# EAGLE design watch_v1_flex_parts_test-rotated (EAGLE 9.6.2)
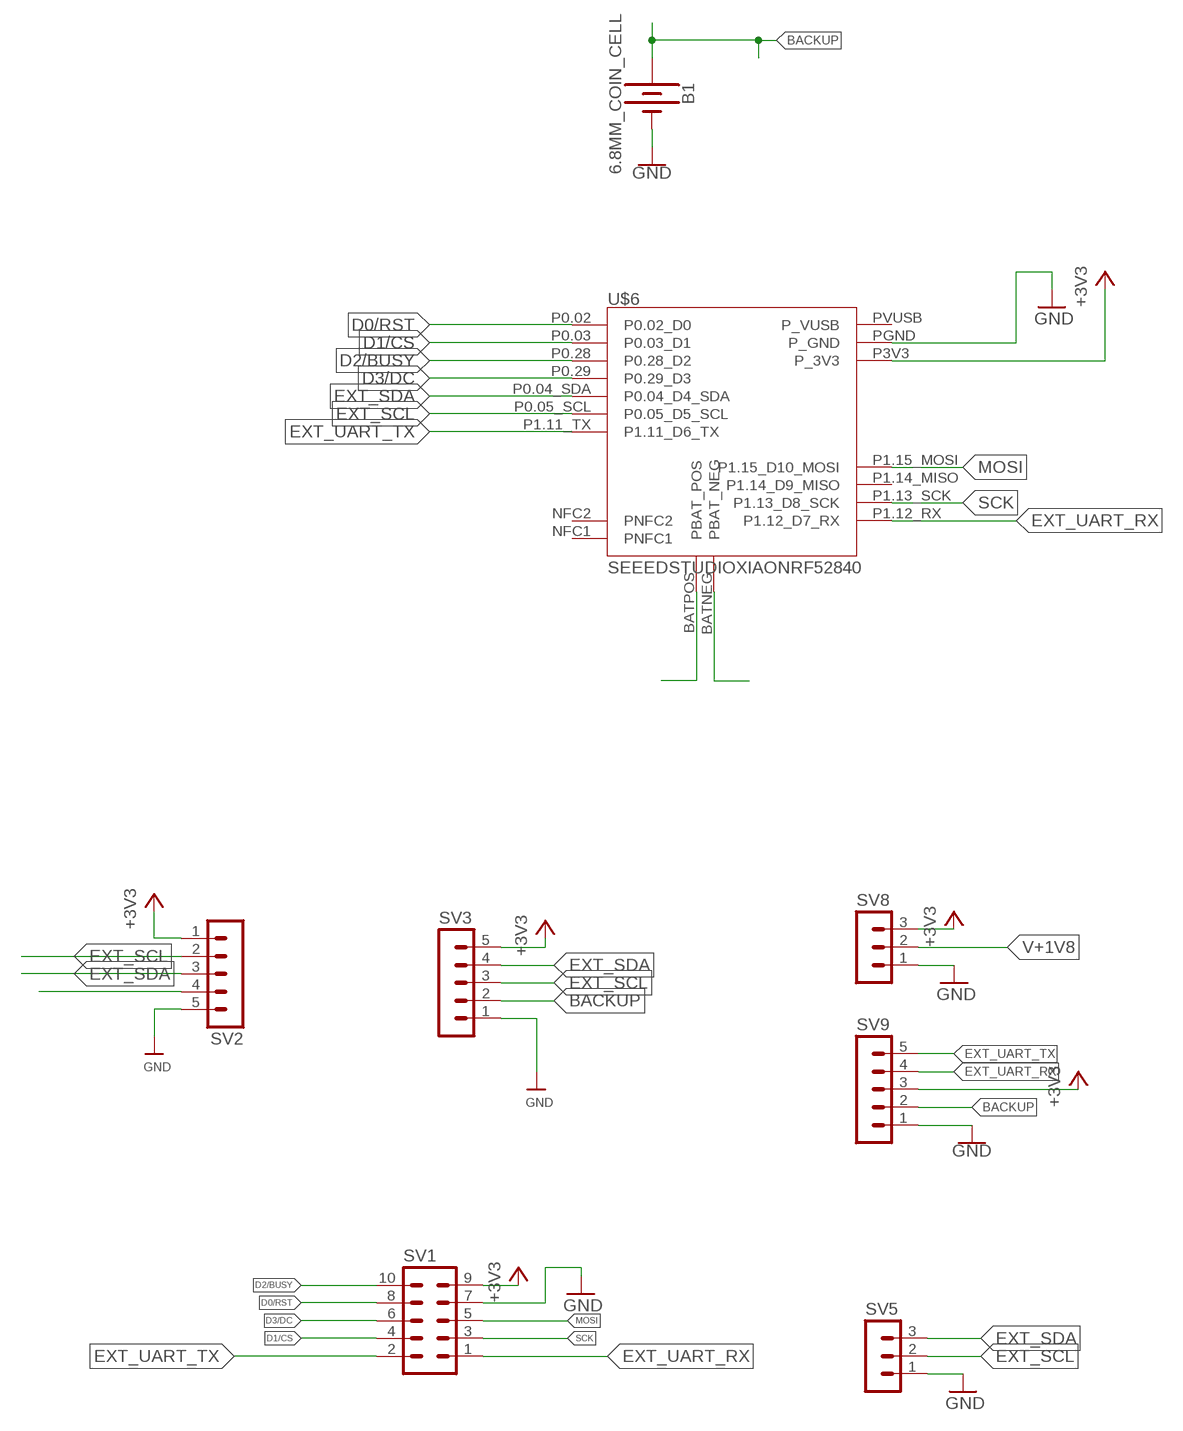
[diagram p0: schematic, sheet 1]

## Parts
B1  6.8MM_COIN_CELL  ML414H_IV01E_BATTERY  [ML414H_IV01E]
SV1  MA05-2  [MA05-2]
SV2  MA05-1  [MA05-1]
SV3  MA05-1  [MA05-1]
SV5  MA03-1  [MA03-1]
SV8  MA03-1  [MA03-1]
SV9  MA05-1  [MA05-1]
U$6  SEEEDSTUDIOXIAONRF52840  [SEEEDSTUDIOXIAONRF52840]

## Nets
+3V3: SV1.9 SV2.1 SV3.5 SV8.3 SV9.3 U$6.P3V3(P_3V3)
BACKUP: B1.+ SV3.2 SV9.2
D0/RST: SV1.8 U$6.P0.02(P0.02_D0)
D1/CS: SV1.4 U$6.P0.03(P0.03_D1)
D2/BUSY: SV1.10 U$6.P0.28(P0.28_D2)
D3/DC: SV1.6 U$6.P0.29(P0.29_D3)
EXT_SCL: SV2.2 SV3.3 SV5.2 U$6.P0.05_SCL(P0.05_D5_SCL)
EXT_SDA: SV2.3 SV3.4 SV5.3 U$6.P0.04_SDA(P0.04_D4_SDA)
EXT_UART_RX: SV1.1 SV9.4 U$6.P1.12_RX(P1.12_D7_RX)
EXT_UART_TX: SV1.2 SV9.5 U$6.P1.11_TX(P1.11_D6_TX)
GND: B1.- SV1.7 SV2.5 SV3.1 SV5.1 SV8.1 SV9.1 U$6.PGND(P_GND)
MOSI: SV1.5 U$6.P1.15_MOSI(P1.15_D10_MOSI)
N$1: SV2.4
N$18: U$6.BATPOS(PBAT_POS)
N$25: U$6.BATNEG(PBAT_NEG)
SCK: SV1.3 U$6.P1.13_SCK(P1.13_D8_SCK)
V+1V8: SV8.2
Unconnected: U$6.NFC1 U$6.NFC2 U$6.P1.14_MISO(P1.14_D9_MISO) U$6.PVUSB(P_VUSB)

## Library data of the parts
B1 = SparkFun-Batteries:ML414H_IV01E_BATTERY: SEIKO ML414H-IV01E Reflowable Lithium Battery ML414H is a rechargeable, coin type battery with features such as Pb-free reflowable (Peak temperature: 260 C) and high temperature heat resistance. Battery Characteristics: 3.1V max voltage Voff is 2V 1mAH 3k series resistor with battery 72 hour charge time from 2.0-3.1V 2.3-2.8V initial charge; PROD_ID: BATT-14267
SV1 = con-lstb:MA05-2: PIN HEADER; OC_FARNELL: unknown; OC_NEWARK: unknown
SV2 SV3 SV9 = con-lstb:MA05-1: PIN HEADER; OC_FARNELL: unknown; OC_NEWARK: unknown
SV5 SV8 = con-lstb:MA03-1: PIN HEADER; OC_FARNELL: unknown; OC_NEWARK: unknown
U$6 = selby-stuff:SEEEDSTUDIOXIAONRF52840

## Net classes
2 3.3V: width 0.508 mm, drill 0.305 mm
3 RF: width 0.889 mm, drill 0.305 mm, clearance 0.203 mm

## Board
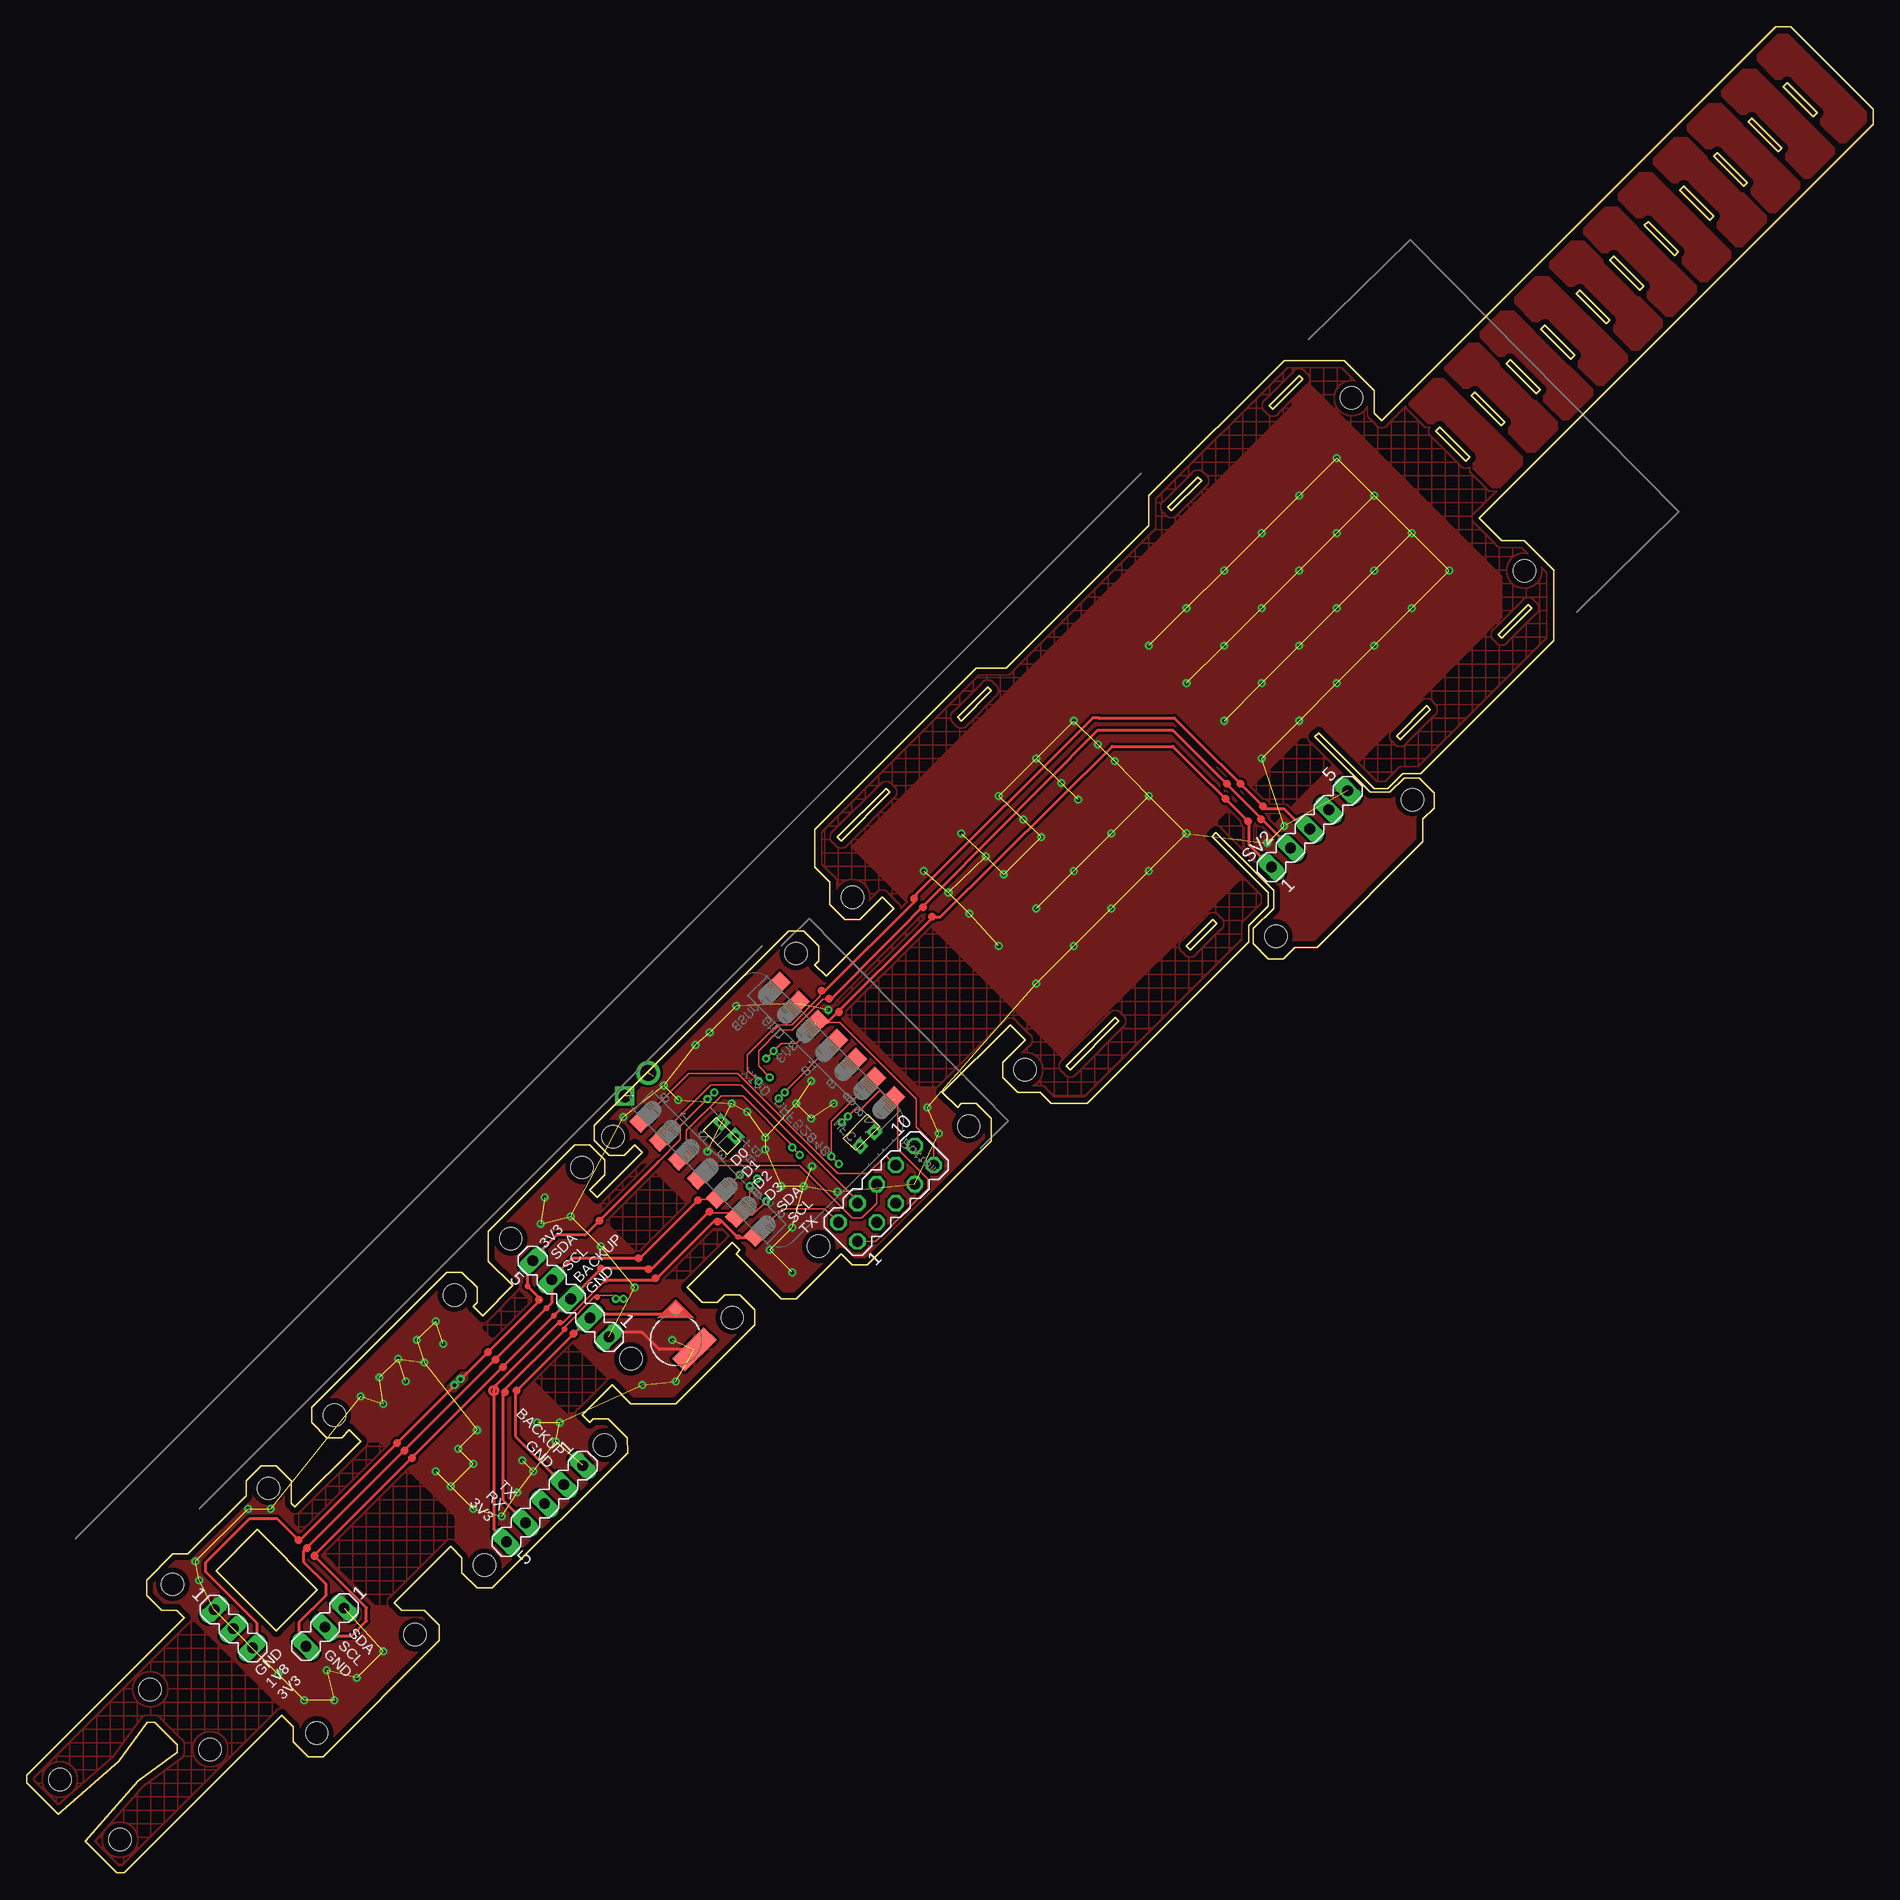
[diagram p1: board, top side]
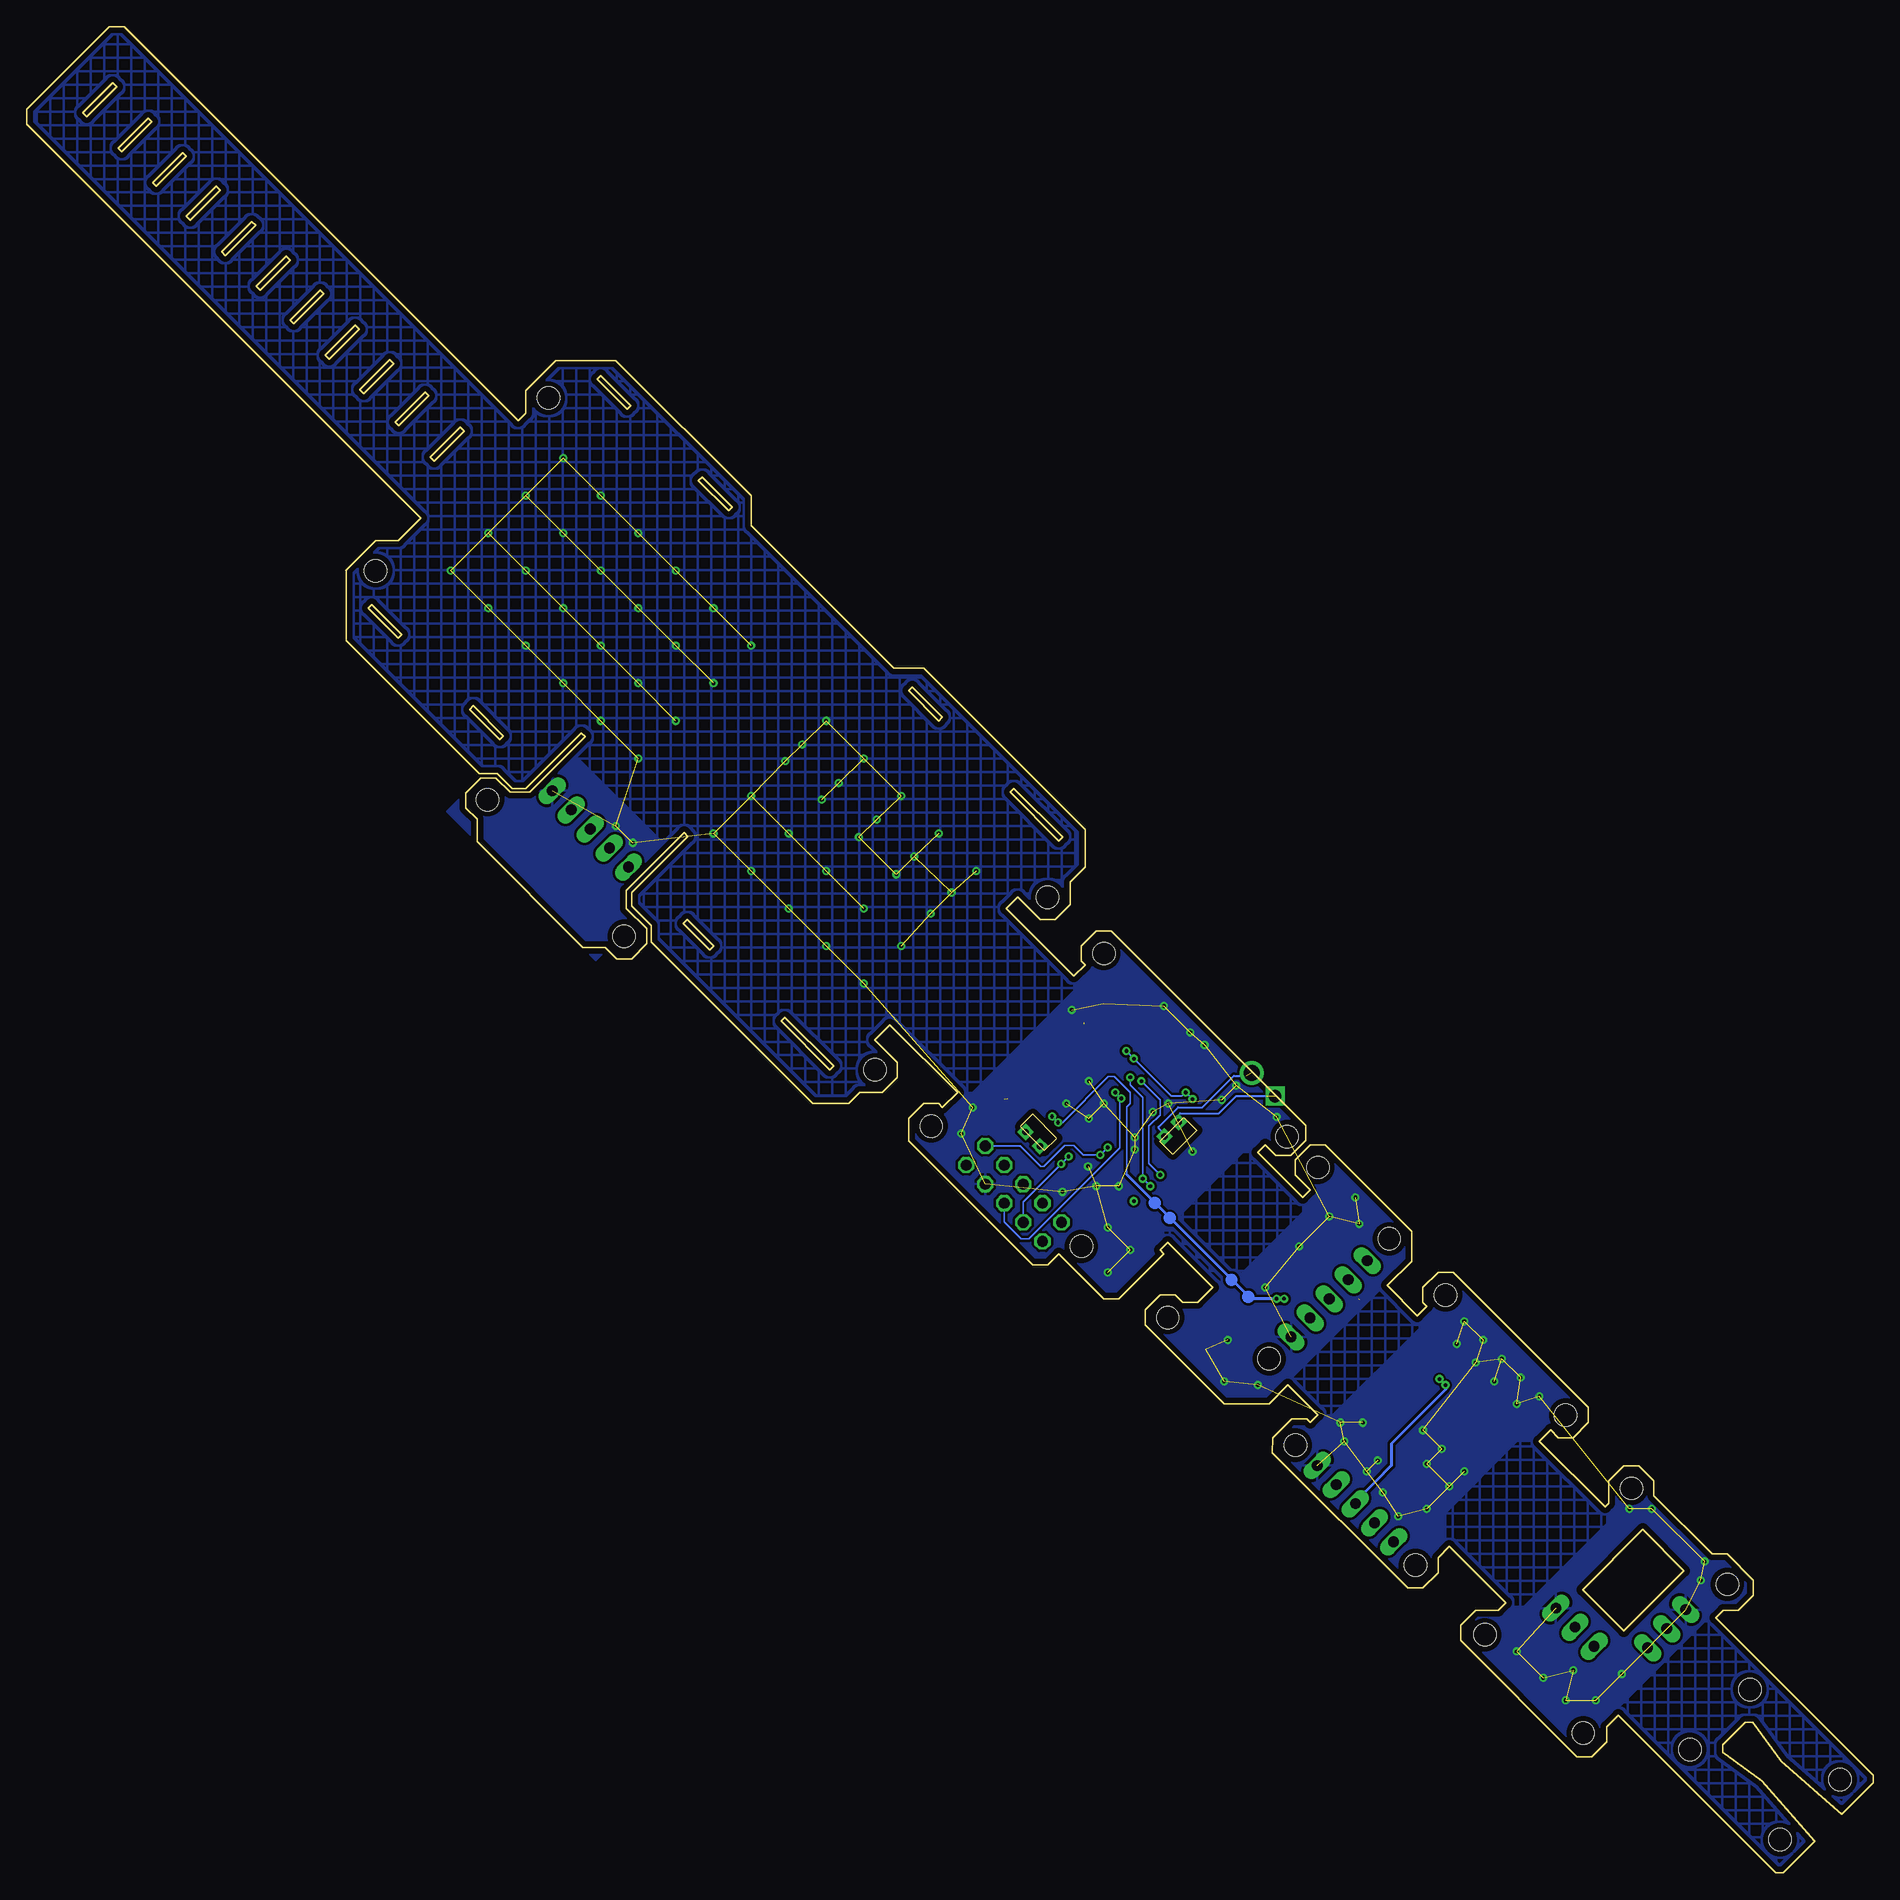
[diagram p2: board, bottom side, seen from below]

Size 173.95 x 173.95 mm. Coordinates in mm from the lower left corner, seen from the top.
Outline: 143.83,122.75 141.07,125.51 138.95,125.51 136.83,127.63 173.95,164.76 173.95,166.17 166.17,173.95 164.76,173.95 127.63,136.83 126.93,137.53 126.93,139.65 124.1,142.48 118.44,142.48 105.71,129.75 105.71,126.93 92.28,113.49 89.45,113.49 74.25,98.29 74.25,94.75 75.66,93.34 75.66,91.22 77.07,89.8 78.49,89.8 80.61,91.92 81.67,90.86 75.31,84.5 74.25,85.56 74.6,85.91 74.6,87.33 73.19,88.74 71.77,88.74 53.46,70.43 53.46,69.01 54.87,67.6 56.29,67.6 57.28,68.59 57.98,67.88 53.74,63.64 53.03,64.35 54.45,65.76 54.45,67.18 53.03,68.59 51.62,68.59 43.49,60.46 43.49,57.63 45.79,55.33 42.96,52.5 42.07,53.39 42.43,53.74 42.43,55.15 41.01,56.57 39.6,56.57 26.87,43.84 26.87,42.43 28.28,41.01 29.7,41.01 30.41,41.72 31.47,40.66 25.28,34.47 24.93,34.83 24.93,36.95 23.51,38.36 22.1,38.36 20.68,36.95 20.68,35.53 15.2,30.05 13.79,30.05 11.31,27.58 11.31,26.16 12.73,24.75 14.14,24.75 14.85,24.04 0,9.19 0,8.49 2.98,5.51 8.68,10.51 11.36,14.19 12.07,14.19 14.19,12.07 14.19,11.36 10.51,8.68 5.51,2.98 8.49,0 9.19,0 24.04,14.85 25.1,13.79 25.1,12.37 26.52,10.96 27.93,10.96 38.89,21.92 38.89,23.33 37.48,24.75 35.36,24.75 34.65,25.46 39.95,30.76 41.01,29.7 41.01,28.28 42.43,26.87 43.88,26.86 56.61,39.58 56.57,41.01 54.8,42.78 53.39,42.78 53.03,42.43 52.33,43.13 55.15,45.96 56.92,44.19 61.16,44.19 68.59,51.62 68.59,53.03 67.18,54.45 65.76,54.45 65.05,53.74 63.64,53.74 62.23,55.15 66.47,59.4 67.18,58.69 66.82,58.34 71.06,54.09 72.48,54.09 76.72,58.34 77.78,57.28 79.2,57.28 90.86,68.94 90.86,71.06 89.45,72.48 88.04,72.48 87.68,72.13 86.27,73.54 92.63,79.9 94.05,78.49 91.92,76.37 91.92,74.95 93.34,73.54 95.46,73.54 96.52,72.48 99.91,72.48 115.12,87.68 115.12,89.24 116.96,91.08 116.96,92.35 111.65,97.65 112.01,98.01 117.45,92.56 117.45,90.86 115.54,88.95 115.54,87.54 116.96,86.13 118.37,86.13 119.43,87.19 121.55,87.19 131.52,97.16 131.52,99.28 132.58,100.34 132.58,101.75 131.17,103.17 129.75,103.17 128.41,101.82 126.57,101.82 121.34,107.06 121.69,107.41 126.93,102.18 128.2,102.18 129.61,103.59 131.31,103.59 143.83,116.11 143.83,122.75
Outline: 143.83,122.75 143.9,122.68
Outline: 17.85,28.46 23.51,22.8 27.4,26.69 21.74,32.35 17.85,28.46
Outline: 98.29,75.66 97.93,76.01 102.53,80.61 102.88,80.26 98.29,75.66
Outline: 76.72,97.23 76.37,97.58 80.96,102.18 81.32,101.82 76.72,97.23
Outline: 88.04,108.54 87.68,108.89 90.51,111.72 90.86,111.37 88.04,108.54
Outline: 117.38,137.89 117.03,138.24 119.85,141.07 120.21,140.71 117.38,137.89
Outline: 138.95,116.32 138.59,116.67 141.42,119.5 141.78,119.15 138.95,116.32
Outline: 129.4,106.77 129.05,107.13 131.88,109.96 132.23,109.6 129.4,106.77
Outline: 107.83,128.34 107.48,128.69 110.31,131.52 110.66,131.17 107.83,128.34
Outline: 109.6,86.97 109.25,87.33 111.72,89.8 112.08,89.45 109.6,86.97
Outline: 168.65,165.82 168.29,165.46 165.46,168.29 165.82,168.65 168.65,165.82
Outline: 165.32,162.49 164.97,162.14 162.14,164.97 162.49,165.32 165.32,162.49
Outline: 162.07,159.24 161.72,158.89 158.89,161.72 159.24,162.07 162.07,159.24
Outline: 158.89,156.06 158.53,155.71 155.71,158.53 156.06,158.89 158.89,156.06
Outline: 155.56,152.74 155.21,152.38 152.38,155.21 152.74,155.56 155.56,152.74
Outline: 152.31,149.48 151.96,149.13 149.13,151.96 149.48,152.31 152.31,149.48
Outline: 149.13,146.3 148.78,145.95 145.95,148.78 146.3,149.13 149.13,146.3
Outline: 145.81,142.98 145.45,142.62 142.62,145.45 142.98,145.81 145.81,142.98
Outline: 142.55,139.72 142.2,139.37 139.37,142.2 139.72,142.55 142.55,139.72
Outline: 139.23,136.68 138.88,136.33 136.05,139.16 136.4,139.51 139.23,136.68
Outline: 135.91,133.36 135.55,133.01 132.72,135.84 133.08,136.19 135.91,133.36
Copper layers (1*16): Top 0.035mm / dielectric 1.5mm / Bottom 0.035mm
Design rules "default *": minimum track width 9mil, minimum drill 0.35mm, track to track 9mil, track to pad 0.25mm, pad to pad 9mil, via to via 9mil, smd to smd 6mil, copper to edge 20mil, drill to drill 6mil, minimum pad ring 10mil, minimum via ring 8mil, stop-mask expansion 4mil, vias tented up to drill 40mm, thermal gap 10mil
Holes 2.1 mm at 88.74,70.36 72.48,86.62 55.23,69.37 52.33,66.47 66.47,52.33 56.92,48.44 74.6,59.04 54.45,40.31 43.13,28.99 40.31,54.45 28.99,43.13 36.59,22.45 22.8,36.24 13.75,27.19 27.33,13.19 45.61,59.75 77.78,91.92 124.8,138.95 141.07,122.68 94.05,75.66 3.15,8.8 11.63,17.29 17.29,11.63 8.8,3.15 117.66,88.25 130.53,101.12

### Footprints (pad centres in the part's own frame; a part is rotated, then mirrored left to right if it is on the bottom)
ML414H_IV01E = smd 1 x 1: + 2.022,2.032 | smd 4.2 x 1.7: - 0.6,-1.85
MA05-2 = drill 1.016 octagon: 1 -5.08,-1.27; 2 -5.08,1.27; 3 -2.54,-1.27; 4 -2.54,1.27; 5 0,-1.27; 6 0,1.27; 7 2.54,-1.27; 8 2.54,1.27; 9 5.08,-1.27; 10 5.08,1.27
MA05-1 = drill 1.016 long: 1 -5.08,0; 2 -2.54,0; 3 0,0; 4 2.54,0; 5 5.08,0
MA03-1 = drill 1.016 long: 1 -2.54,0; 2 0,0; 3 2.54,0
SEEEDSTUDIOXIAONRF52840 = drill 0.6 square: BATNEG 2.55,3.85; BATPOS 0.65,3.85; NFC1 -8.3,-3.8; NFC2 -8.3,-5.7 | smd 1.5 x 2: P0.02 7.957,8.918; P0.03 5.417,8.918; P0.04_SDA -2.203,8.918; P0.05_SCL -4.743,8.918; P0.28 2.877,8.918; P0.29 0.337,8.918; P1.11_TX -7.283,8.918; P1.12_RX -7.283,-9.082; P1.13_SCK -4.743,-9.082; P1.14_MISO -2.203,-9.082; P1.15_MOSI 0.337,-9.082; P3V3 2.877,-9.082; PGND 5.417,-9.082; PVUSB 7.957,-9.082

### Placement (x,y rotation side)
B1  61.16,50.2 45 top
SV1  80.96,63.99 45 top
SV2  120.84,98.36 45 top
SV3  51.27,54.09 135 top
SV5  28.11,23.16 225 top
SV8  19.48,23.02 315 top
SV9  48.79,34.79 225 top
U$6  69.95,71.65 135 top

### Tracks (layer width: path | path; a pad name or v marks a point on that pad's centre or on a via)
+3V3  (via drill 0.35)  (2 unrouted)
  Top 0.152: U$6.P3V3 75.16,80.11 | SV1.9 85.45,68.62 83.79,70.28 83.79,72.92 76.6,80.11 U$6.P3V3 | U$6.P3V3 75.42,80.11 | 74.34,80 72.48,78.14 71.06,78.14 v70.36,77.43 v69.65,76.72 | 59.49,66.98 61.59,69.08 61.59,70.36 v64.13,72.9 v64.77,73.54 | SV8.3 21.67,21.61
  Top 0.203: v40.87,46.53 40.87,46.46
  Top 0.229: 48.45,54.05 48.46,54.05
  Top 0.305: 59.49,66.98 52.61,60.1 49.92,60.1 47.67,57.86 SV3.5 47.18,57.19 47.18,55.32 48.45,54.05 | 21.67,21.61 21.67,23.56 16.88,28.35 16.88,29.25 21.03,33.41 23.58,33.41 25.7,31.29 40.87,46.46 48.4,53.99 | 75.42,80.11 85.39,90.08 86.06,90.08 102.24,106.14 107.98,106.14 115.12,99 115.12,96.9 SV2.1
  Bottom 0.152: v64.13,72.9 v64.77,73.54 65.12,73.19 66.11,73.19 v69.65,76.72 v70.36,77.43 | 46.92,36.87 46.92,36.86
  Bottom 0.305: v40.87,46.53 v40.31,45.96 40.31,45.54 45.4,40.45 45.4,38.39 46.92,36.87 | 46.92,36.86 48.79,34.99 SV9.3
  pour Top: 39.67,45.33 39.67,45.89 40.94,47.16 41.51,47.16 41.51,46.46 40.45,45.4 40.38,45.33
BACKUP
  Top 0.152: SV3.2 53.05,52.3
  Top 0.305: SV3.2 53.39,52.63 60.71,52.63 B1.+ | 53.05,52.3 46.03,45.28 46.03,41.14 SV9.2
D0/RST
  Top 0.152: 58.02,71.1 U$6.P0.02 62.36,75.31 67,75.31 76.42,65.89 79.25,65.89 80.93,67.56 80.99,67.56 SV1.8
D1/CS
  Top 0.152: SV1.4 78.27,63.31 67.33,74.25 64.46,74.25 59.82,69.6 U$6.P0.03
D2/BUSY  (via drill 0.35)
  Top 0.152: U$6.P0.28 62.15,67.92 62.15,69.93 65.41,73.19 67.48,73.19 72.11,68.56 v72.11,68.36 v72.81,67.65
  Bottom 0.152: SV1.10 80.36,68.48 78.42,66.54 78.15,66.54 76.17,68.52 75.31,68.52 74.44,67.65 v72.81,67.65 v72.11,68.36
D3/DC
  Top 0.152: SV1.6 80.07,63.1 78.66,61.69 77.78,61.69 72.83,66.63 64.3,66.63 63.41,65.74 U$6.P0.29
EXT_SCL  (via drill 0.35)
  Top 0.152: U$6.P0.05_SCL 66.12,61.99 | U$6.P0.05_SCL 66.79,62.2 64.17,62.2 | SV5.2 27.92,23.35 | 28.84,28.13 27.18,29.79 27.07,29.9 | v69.65,63.29 68.36,61.99 67.18,61.99 | U$6.P0.05_SCL 67.18,61.99 | 67.18,61.99 68.11,62.93 v68.11,64.7 v68.82,65.41 | 75.34,82.37 75.31,82.34 75.05,82.34 72.11,79.4 70.91,79.4 68.94,77.43 68.94,76.01 v70,74.95
  Top 0.305: 64.17,62.2 58.95,56.98 54.15,56.98 SV3.3 27.07,29.9 | 75.34,82.37 75.86,82.37 100.85,107.62 107.99,107.62 SV2.2 | SV5.2 28.9,22.36 30.63,22.36 32.01,23.74 32.01,24.99 31.98,24.99 27.18,29.79
  Bottom 0.152: v70,74.95 70,74.25 68.8,73.04 68.8,70.92 68.84,70.88 68.84,65.43 v68.82,65.41 v68.11,64.7
EXT_SDA  (via drill 0.35)
  Top 0.152: 63.3,63.43 64.85,63.43 U$6.P0.04_SDA v67.18,65.76 | 49.47,56.01 SV3.4 | SV5.3 26.26,21.36 25.64,21.98 | v68.94,74.6 67.88,75.66 67.88,77.08 70.71,79.9 72.07,79.9 74.78,82.61 74.78,82.85 74.9,82.98
  Top 0.305: 63.3,63.43 57.78,57.91 51.37,57.91 49.47,56.01 | SV3.4 49.47,53.71 26.08,30.32 26.08,29.3 28.16,27.22 28.16,26.13 25.64,23.61 25.64,21.98 | 74.9,82.98 75.1,82.98 83.74,91.61 83.74,92.12 83.86,92.24 83.86,92.27 100.41,108.82 100.99,108.82 108.12,108.82 116.67,100.27 118.4,100.27 119.47,99.19 120.01,99.19 SV2.3
  Bottom 0.152: v68.94,74.6 67.18,72.83 67.18,71.42 68.24,70.36 68.24,66.82 v67.18,65.76
EXT_UART_RX  (via drill 0.35)  (1 unrouted)
  Top 0.152: SV1.1 79.97,59.5 84.89,64.42 84.89,65.37 82.04,68.22 82.04,72.89 81.85,72.89 | U$6.P1.12_RX 81.23,72.92 80.47,73.68 80.33,73.68 78.56,71.91 77.99,71.91 v77.36,71.28 v76.79,70.71 76.65,70.57 | v55.51,54.09 55.21,54.39 53.63,54.39 50.59,51.35 50.59,51.09
  Top 0.305: SV9.4 44.9,35.09 44.9,45.4 50.59,51.09 | v55.51,54.09 v56.22,54.09
  Bottom 0.152: 70.34,65.82 70.34,72.15 70.01,72.48 70,73.52 70.22,73.75 71.49,75.02 72.05,75.02 76.37,70.71 v76.79,70.71 v77.36,71.28
  Bottom 0.305: 70.34,65.82 58.62,54.09 v56.22,54.09 v55.51,54.09
EXT_UART_TX
  Top 0.152: SV1.2 75.19,62.58 71.18,62.58 U$6.P1.11_TX 68.42,59.82 | 50.07,51.8 50.07,51.83 50.14,51.76 50.48,51.76 54.52,55.81 54.52,55.87 | 65.34,61.52 64.88,61.52
  Top 0.305: SV9.5 44,32.4 44,45.35 44.24,45.98 50.07,51.8 | 54.52,55.87 59.23,55.87 64.88,61.52 | 68.42,59.82 67.03,59.82 65.34,61.52
GND  (via drill 0.35)  (122 unrouted)
  Top 0.305: B1.- 59.57,49.32 57.98,50.91 55.27,50.91 SV3.1
  other vias: 48.44,61.16 48.79,63.64 51.27,61.87 54.09,59.04 57.28,55.15 60.81,50.2 61.16,46.32 57.98,45.96 50.2,42.43 49.85,40.66 48.08,42.43 46.69,38.86 47.73,37.83 46.2,35.84 40.66,39.95 42.07,38.54 42.43,41.72 38.54,37.83 39.95,36.42 42.07,34.29 33.59,44.19 31.47,44.9 33.23,46.67 35,48.44 36.77,50.2 38.54,51.97 35.71,46.32 37.48,48.08 39.24,49.85 33.59,20.86 31.11,18.38 28.28,19.09 28.99,16.26 26.16,16.26 23.69,18.74 15.91,29.34 16.26,27.58 20.86,34.29 22.98,34.29 66.82,81.67 64.35,79.2 63,77.99 56.21,71.21 84.85,72.12 85.91,69.65 72.12,56.57 70,58.69 72.12,60.81 73.19,64.7 71.06,64.7 73.89,71.06 72.48,72.48 76.01,72.48 73.89,74.6 69.58,69.3 69.58,68.17 44.76,33.59 98.64,87.33 92.02,94.08 105.71,115.61 84.5,94.4 88.03,97.93 91.57,101.47 95.11,105.01 98.64,108.54 95.11,83.79 88.8,90.37 102.18,90.86 95.55,97.57 105.71,94.4 99.05,101.11 109.25,97.93 102.49,104.74 91.57,87.33 95.11,90.86 98.64,94.4 102.18,97.93 105.71,101.47 116.32,105.01 109.25,112.08 112.78,108.54 119.85,108.54 112.78,115.61 116.32,112.08 109.25,119.15 112.78,122.68 116.32,126.22 119.85,129.75 123.39,133.29 123.39,112.08 116.32,119.15 126.93,115.61 119.85,122.68 130.46,119.15 123.39,126.22 134,122.68 126.93,129.75 130.46,126.22 123.39,119.15 126.93,122.68 119.85,115.61 86.83,92.35 90.35,95.75 93.88,99.24 97.46,102.7 100.9,106.33 116.85,97.05 118.44,98.64 75.51,81.32 64.13,67.95 66.4,72.48 61.38,72.83 60.03,74.18 76.38,64.18 73.98,66.58 67.88,71.7
  pour Bottom (rank 3, hatched): -16.26,11.31 18.03,-22.98 26.52,-22.98 199.05,149.55 199.05,151.67 155.56,195.16 -15.91,23.69 -15.91,11.67
  pour Bottom: 24.75,14.14 24.75,12.02 27.22,9.55 39.95,22.27 39.95,22.98 37.83,25.1 32.88,25.1 25.1,32.88 25.1,37.12 25.46,37.48 23.33,39.6 22.63,39.6 10.61,27.58 10.61,26.87 12.73,24.75 14.85,24.75 25.1,14.5
  pour Bottom: 31.11,41.01 31.47,40.66 33.59,40.66 40.31,33.94 40.31,28.99 40.66,28.64 40.66,27.93 42.43,26.16 44.55,26.16 57.98,39.6 54.45,43.13 50.91,43.13 42.78,51.27 42.78,54.8 42.43,55.15 40.39,57.36 26.16,43.13 28.64,40.66
  pour Bottom: 45.25,55.15 46.24,55.15 55.15,46.24 55.15,45.96 57.28,43.84 60.81,43.84 68.94,51.97 68.94,53.39 67.53,54.8 64.7,54.8 63.64,53.74 62.23,55.15 60.81,55.15 53.74,62.23 53.74,63.64 53.03,64.35 53.03,65.05 54.45,66.47 55.15,66.47 51.97,69.65 42.07,59.75 42.07,58.34
  pour Bottom: 113.47,96.5 122.4,105.43 125.64,102.19 128.78,102.19 129.77,103.18 131.18,103.18 134.36,100 120.33,85.97 119.41,86.89 118.35,85.83 116.94,85.83 115.52,87.24 115.52,88.65 117.36,90.49 117.36,92.61
  pour Bottom: 51.97,70.36 54.09,68.24 56.92,68.24 57.28,68.59 57.98,67.88 59.4,67.88 66.82,60.46 66.82,59.75 66.47,59.4 66.47,58.69 71.42,53.74 77.78,53.74 82.73,58.69 91.92,67.88 91.92,71.42 89.8,73.54 84.85,73.54 75.31,83.09 75.31,87.33 71.77,90.86 71.06,90.86 51.97,71.77
  pour Top: 162.99,170.77 164.76,169 166.17,169 169,166.17 169,164.76 170.77,162.99 171.47,162.99 173.59,165.11 173.59,165.82 166.17,173.24 164.76,173.24 162.99,171.47
  pour Top (rank 3, hatched): -21.28,19.73 11.46,-13.01 27.29,-13.01 163.34,123.04 123.11,163.27 114.34,163.27 -21.28,27.65
  pour Top: 97.58,76.79 77.71,96.66 119.22,138.17 119.22,141.85 138.95,122.12 138.95,118.3 124.52,103.73 121.27,106.99 120,106.99 112.15,99.14 112.15,98.15 115.47,94.82 97.79,77.15
  pour Top: 11.03,26.3 13.29,24.04 15.56,24.04 24.75,14.85 24.75,12.02 26.52,10.25 27.79,10.25 39.32,21.78 39.88,21.78 39.88,23.9 38.61,25.17 32.81,25.17 25.1,32.88 25.1,38.4 23.76,39.74 23.19,39.74 10.96,27.51 10.96,26.38
  pour Top (isolate 0.254, rank 2): 26.52,42.78 29.06,40.23 30.19,40.23 30.62,40.66 33.3,40.66 33.38,40.59 40.38,33.59 40.38,27.37 42.36,25.39 43.63,25.39 57.7,39.46 57.7,41.01 55.58,43.13 55.58,43.27 51.05,43.27 50.91,43.13 42.85,51.19 42.85,52.61 41.93,53.53 41.93,58.05 40.87,59.11 38.89,59.11 26.45,46.67 26.45,42.99
  pour Top: 43.42,57.56 45.89,55.08 46.32,55.08 57.49,43.91 62.72,43.91 69.37,50.56 69.37,53.1 66.61,55.86 59.96,55.86 54.16,61.66 54.16,66.19 54.66,66.68 55.08,66.68 52.4,69.37 52.4,69.93 43.42,60.95
  pour Top: 52.61,69.72 54.52,67.81 57.49,67.81 67.6,57.7 67.6,57.28 71.13,53.74 75.09,53.74 77.36,56 81.88,56 91.78,65.9 91.78,71.56 89.31,74.03 83.93,74.03 75.38,82.59 75.38,86.97 72.69,89.66 71.7,89.66 52.4,70.36 52.4,70.07
  pour Top: 114.42,95.59 117.38,92.63 117.38,91.22 115.33,89.17 115.19,89.17 115.19,87.19 117.38,84.99 120.63,84.99 133.78,98.15 133.78,101.12 131.45,103.45 129.33,103.45 127.7,101.82 126.43,101.82 123.45,104.8
GND1
  pour Top: 159.66,167.44 161.43,165.68 162.85,165.68 165.68,162.85 165.68,161.43 167.44,159.66 168.15,159.66 170.27,161.79 170.27,162.49 162.85,169.92 161.43,169.92 159.66,168.15
GND2
  pour Top: 156.41,164.19 158.18,162.42 159.59,162.42 162.42,159.59 162.42,158.18 164.19,156.41 164.9,156.41 167.02,158.53 167.02,159.24 159.59,166.67 158.18,166.67 156.41,164.9
GND3
  pour Top: 153.23,161.01 155,159.24 156.41,159.24 159.24,156.41 159.24,155 161.01,153.23 161.72,153.23 163.84,155.35 163.84,156.06 156.41,163.48 155,163.48 153.23,161.72
GND4
  pour Top: 149.91,157.68 151.67,155.92 153.09,155.92 155.92,153.09 155.92,151.67 157.68,149.91 158.39,149.91 160.51,152.03 160.51,152.74 153.09,160.16 151.67,160.16 149.91,158.39
GND5
  pour Top: 146.65,154.43 148.42,152.66 149.84,152.66 152.66,149.84 152.66,148.42 154.43,146.65 155.14,146.65 157.26,148.78 157.26,149.48 149.84,156.91 148.42,156.91 146.65,155.14
GND6
  pour Top: 143.47,151.25 145.24,149.48 146.65,149.48 149.48,146.65 149.48,145.24 151.25,143.47 151.96,143.47 154.08,145.59 154.08,146.3 146.65,153.73 145.24,153.73 143.47,151.96
GND7
  pour Top: 140.15,147.93 141.92,146.16 143.33,146.16 146.16,143.33 146.16,141.92 147.93,140.15 148.63,140.15 150.76,142.27 150.76,142.98 143.33,150.4 141.92,150.4 140.15,148.63
GND8
  pour Top: 136.9,144.67 138.66,142.91 140.08,142.91 142.91,140.08 142.91,138.66 144.67,136.9 145.38,136.9 147.5,139.02 147.5,139.72 140.08,147.15 138.66,147.15 136.9,145.38
GND9
  pour Top: 133.57,141.63 135.34,139.87 136.75,139.87 139.58,137.04 139.58,135.62 141.35,133.86 142.06,133.86 144.18,135.98 144.18,136.68 136.75,144.11 135.34,144.11 133.57,142.34
GND10
  pour Top: 130.25,138.31 132.02,136.54 133.43,136.54 136.26,133.71 136.26,132.3 138.03,130.53 138.73,130.53 140.86,132.65 140.86,133.36 133.43,140.78 132.02,140.78 130.25,139.02
MOSI  (via drill 0.35)
  Top 0.152: v71.42,73.54 71.42,73.59 | 71.42,73.59 U$6.P1.15_MOSI | v70.85,72.97 70.85,73.03 71.42,73.59
  Bottom 0.152: SV1.5 81.86,61.34 80.27,59.75 79.55,59.75 70.99,68.31 70.99,72.84 v70.85,72.97 v71.42,73.54
N$18  (via drill 1.5)  (1 unrouted)
  Bottom 0.152: U$6.BATPOS 66.77,69.6
  Bottom 0.203: 66.77,69.6 67.32,70.15 67.32,70.29 65.48,72.13 63.22,72.13 60.25,75.1 59.09,75.1
  other vias: 58.55,75.38
N$25  (via drill 1.2)  (1 unrouted)
  Bottom 0.203: U$6.BATNEG 65.71,71.02 65.71,71.16 65.31,71.56 61.66,71.56 60.03,73.19 57.19,73.19
  other vias: 56.36,73.19
SCK  (via drill 0.35)
  Top 0.152: U$6.P1.13_SCK 75.8,70.79 v75.8,67.49 v76.51,66.79
  Bottom 0.152: SV1.3 80.07,63.23 v76.51,66.79 | v75.8,67.49 v76.51,66.79 | v76.51,66.79 76.86,66.43
(copper drawn outside any net)
  shapes: Bottom circle x4, Top circle x43

### Text on the board
tNames: D0 / D1 / D2 / D3 / SDA / SCL / TX | 3V3 / SDA / SCL / BACKUP / GND | BACKUP / GND | TX / RX / 3V3 | SDA / SCL / GND | GND / 1V8 / 3V3